# EAGLE design MTV5Beta (EAGLE 6.5.0)
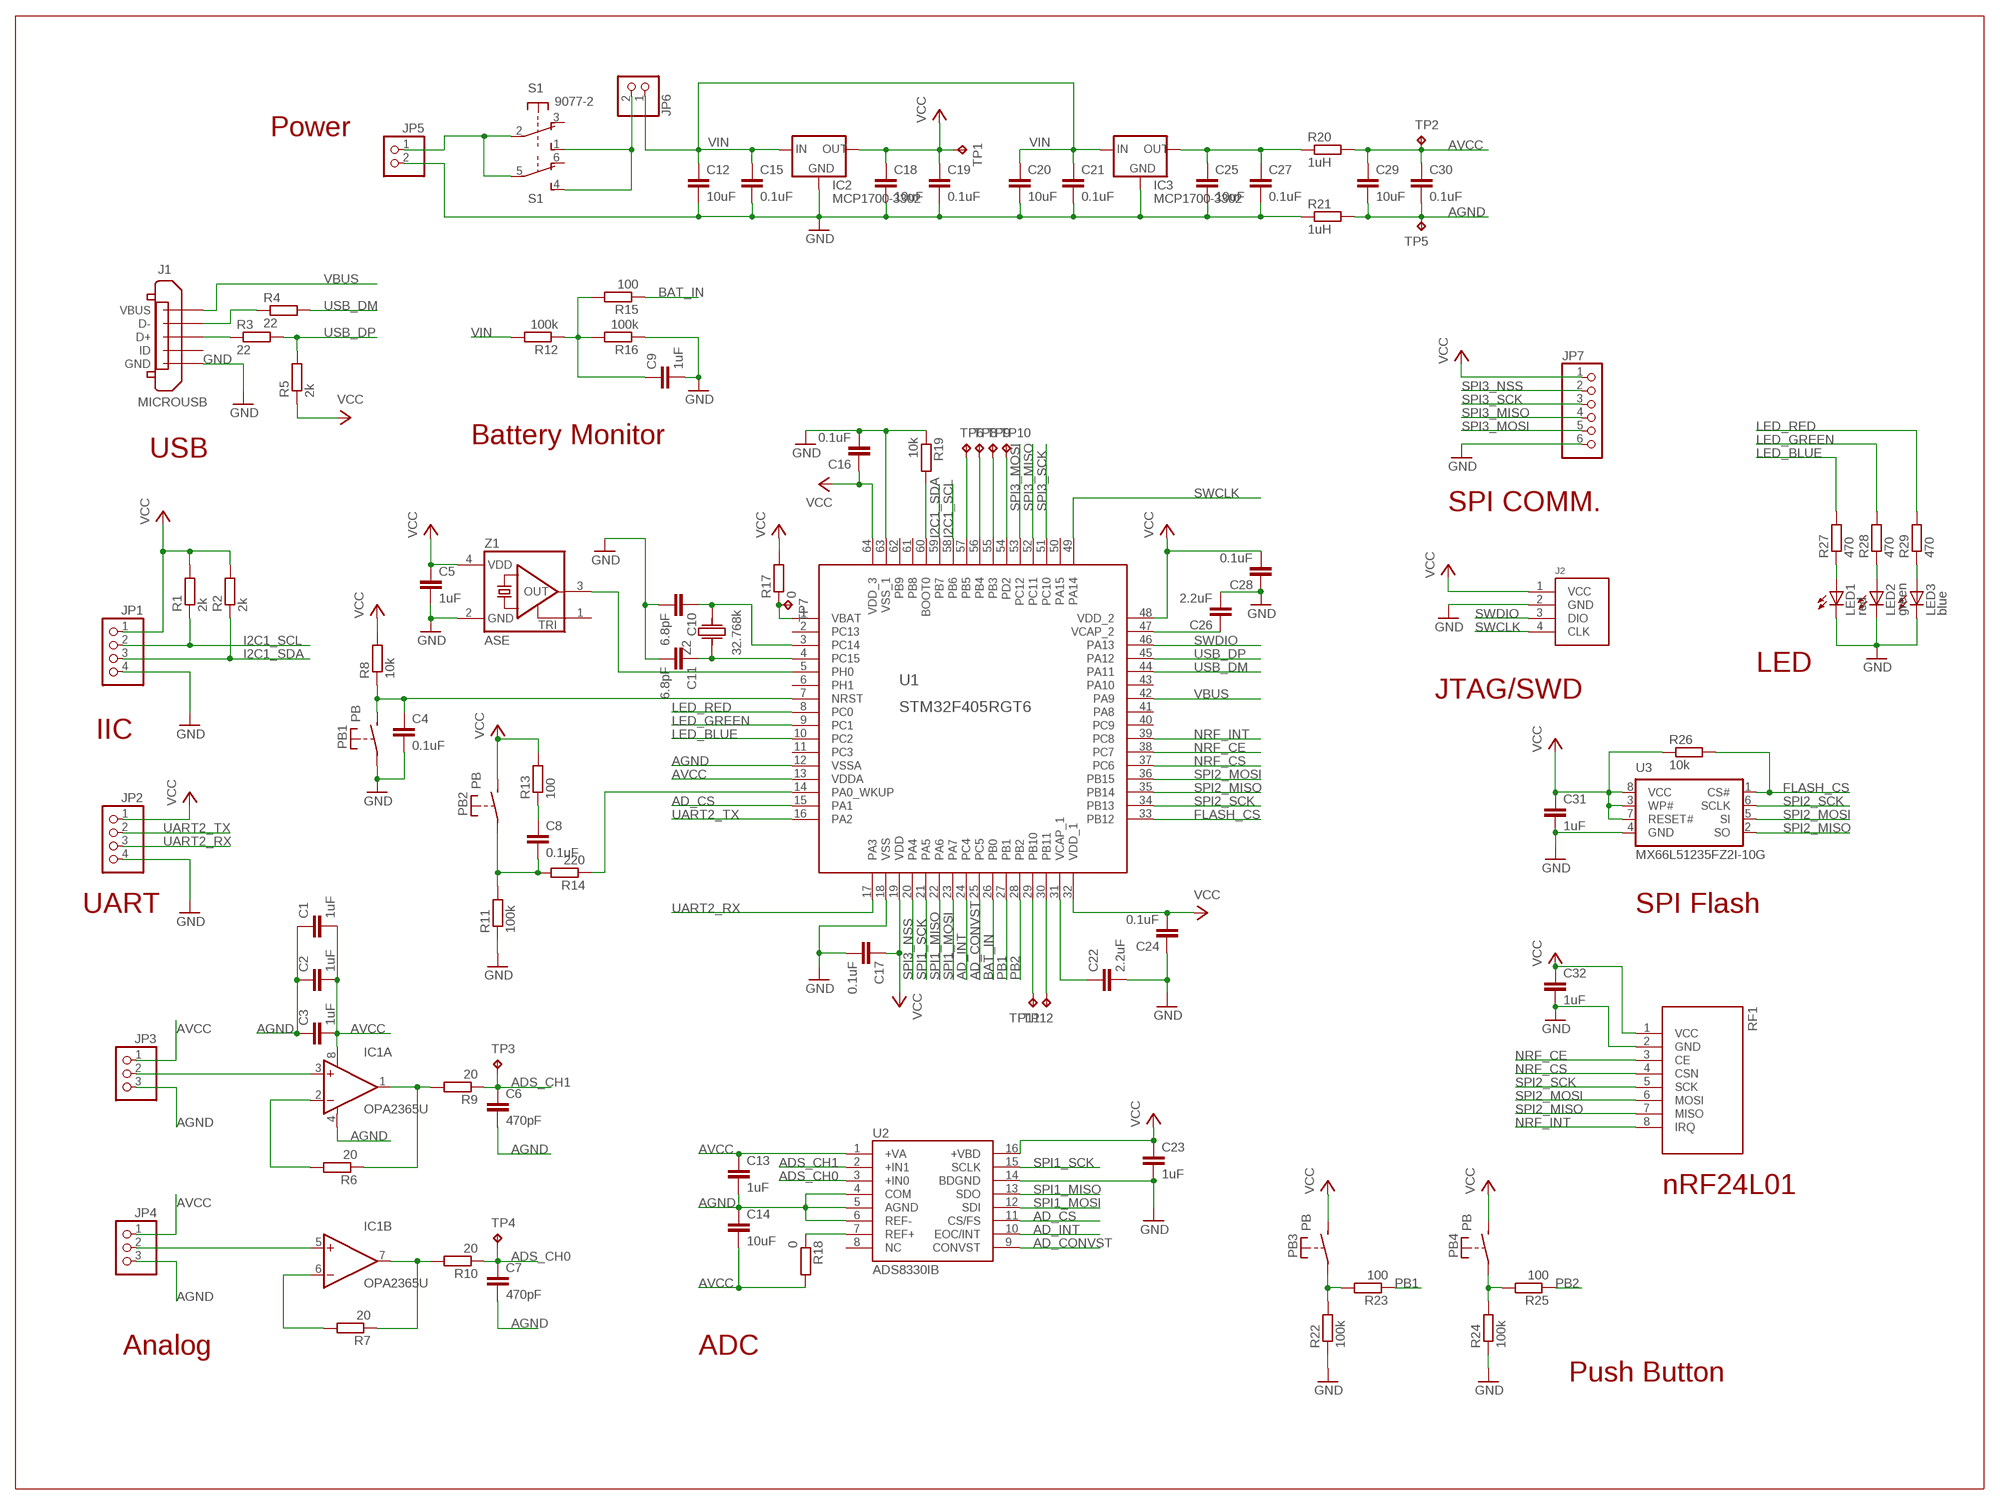
[diagram p0: schematic, sheet 1]

## Parts
C1  1uF  C-EUC0603  [C0603]
C2  1uF  C-EUC0603  [C0603]
C3  1uF  C-EUC0603  [C0603]
C4  0.1uF  C-EUC0603  [C0603]
C5  1uF  C-EUC0603  [C0603]
C6  470pF  C-EUC0603  [C0603]
C7  470pF  C-EUC0603  [C0603]
C8  0.1uF  C-EUC0603  [C0603]
C9  1uF  C-EUC0603  [C0603]
C10  6.8pF  C-EUC0603  [C0603]
C11  6.8pF  C-EUC0603  [C0603]
C12  10uF  C-EUC0603  [C0603]
C13  1uF  C-EUC0603  [C0603]
C14  10uF  C-EUC0603  [C0603]
C15  0.1uF  C-EUC0603  [C0603]
C16  0.1uF  C-EUC0603  [C0603]
C17  0.1uF  C-EUC0603  [C0603]
C18  10uF  C-EUC0603  [C0603]
C19  0.1uF  C-EUC0603  [C0603]
C20  10uF  C-EUC0603  [C0603]
C21  0.1uF  C-EUC0603  [C0603]
C22  2.2uF  C-EUC0603  [C0603]
C23  1uF  C-EUC0603  [C0603]
C24  0.1uF  C-EUC0603  [C0603]
C25  10uF  C-EUC0603  [C0603]
C26  2.2uF  C-EUC0603  [C0603]
C27  0.1uF  C-EUC0603  [C0603]
C28  0.1uF  C-EUC0603  [C0603]
C29  10uF  C-EUC0603  [C0603]
C30  0.1uF  C-EUC0603  [C0603]
C31  1uF  C-EUC0603  [C0603]
C32  1uF  C-EUC0603  [C0603]
IC1  OPA2365U  [SO08]
IC2  MCP1700-3302  XC63FPM  [SOT23]
IC3  MCP1700-3302  XC63FPM  [SOT23]
J1  MICROUSB  [MOLEX47346]
J2  SWDPORT  [125-4P]
JP1  PINHD-1X4  [1X04]
JP2  PINHD-1X4  [1X04]
JP3  PINHD-1X3  [1X03]
JP4  PINHD-1X3  [1X03]
JP5  PINHD-1X2  [1X02]
JP6  PINHD-1X2  [1X02]
JP7  PINHD-1X6  [1X06]
LED1  red  LEDCHIP-LED0805  [CHIP-LED0805]
LED2  green  LEDCHIP-LED0805  [CHIP-LED0805]
LED3  blue  LEDCHIP-LED0805  [CHIP-LED0805]
PB1  PB  [BUTTON]
PB2  PB  [BUTTON]
PB3  PB  [BUTTON]
PB4  PB  [BUTTON]
R1  2k  R-EU_R0603  [R0603]
R2  2k  R-EU_R0603  [R0603]
R3  22  R-EU_R0603  [R0603]
R4  22  R-EU_R0603  [R0603]
R5  2k  R-EU_R0603  [R0603]
R6  20  R-EU_R0603  [R0603]
R7  20  R-EU_R0603  [R0603]
R8  10k  R-EU_R0603  [R0603]
R9  20  R-EU_R0603  [R0603]
R10  20  R-EU_R0603  [R0603]
R11  100k  R-EU_R0603  [R0603]
R12  100k  R-EU_R0603  [R0603]
R13  100  R-EU_R0603  [R0603]
R14  220  R-EU_R0603  [R0603]
R15  100  R-EU_R0603  [R0603]
R16  100k  R-EU_R0603  [R0603]
R17  0  R-EU_R0603  [R0603]
R18  0  R-EU_R0603  [R0603]
R19  10k  R-EU_R0603  [R0603]
R20  1uH  R-EU_R0603  [R0603]
R21  1uH  R-EU_R0603  [R0603]
R22  100k  R-EU_R0603  [R0603]
R23  100  R-EU_R0603  [R0603]
R24  100k  R-EU_R0603  [R0603]
R25  100  R-EU_R0603  [R0603]
R26  10k  R-EU_R0603  [R0603]
R27  470  R-EU_R0603  [R0603]
R28  470  R-EU_R0603  [R0603]
R29  470  R-EU_R0603  [R0603]
RF1  NRF24L01  [NRF24L01-MINI]
S1  9077-2  [9077-2]
TP1  TPB1,27  [B1,27]
TP2  TPB1,27  [B1,27]
TP3  TPB1,27  [B1,27]
TP4  TPB1,27  [B1,27]
TP5  TPB1,27  [B1,27]
TP6  TPB1,27  [B1,27]
TP7  TPB1,27  [B1,27]
TP8  TPB1,27  [B1,27]
TP9  TPB1,27  [B1,27]
TP10  TPB1,27  [B1,27]
TP11  TPB1,27  [B1,27]
TP12  TPB1,27  [B1,27]
U1  STM32F405RGT6  [LQFP64]
U2  ADS8330IB  [TSSOP16]
U3  MX66L51235FZ2I-10G  [WSON8L]
Z1  ASE  [ASE]
Z2  32.768k  CRYSTAL-CM315  [CM315]

## Nets
AD_CONVST: U1.25(PC5) U2.9(CONVST)
AD_CS: U1.15(PA1) U2.11(CS/FS)
AD_INT: U1.24(PC4) U2.10(EOC/INT)
ADS_CH0: C7.1 R10.1 TP4.TP U2.3(+IN0)
ADS_CH1: C6.1 R9.1 TP3.TP U2.2(+IN1)
AGND: C1.1 C2.1 C3.1 C6.2 C7.2 C13.2 C14.1 C29.2 C30.2 IC1.4(A:V-) JP3.3 JP4.3 R21.2 TP5.TP U1.12(VSSA) U2.4(COM) U2.5(AGND) U2.6(REF-)
AVCC: C1.2 C2.2 C3.2 C13.1 C14.2 C29.1 C30.1 IC1.8(A:V+) JP3.1 JP4.1 R18.2 R20.2 TP2.TP U1.13(VDDA) U2.1(+VA)
BAT_IN: R15.1 U1.26(PB0)
FLASH_CS: R26.2 U1.33(PB12) U3.1(CS#)
GND: C4.2 C5.2 C9.2 C10.2 C11.2 C12.2 C15.2 C16.2 C17.2 C18.2 C19.2 C20.2 C21.2 C22.2 C23.2 C24.1 C25.2 C26.2 C27.2 C28.1 C31.2 C32.2 IC2.1(GND) IC3.1(GND) J1.5(GND) J2.2(GND) JP1.4 JP2.4 JP5.2 JP7.6 LED1.C LED2.C LED3.C PB1.1(P) R11.1 R16.1 R19.1 R21.1 R22.1 R24.1 RF1.2(GND) U1.18(VSS) U1.63(VSS_1) U2.14(BDGND) U3.4(GND) Z1.2(GND)
I2C1_SCL: JP1.2 R1.1 U1.58(PB6)
I2C1_SDA: JP1.3 R2.1 U1.59(PB7)
LED_BLUE: R27.2 U1.10(PC2)
LED_GREEN: R28.2 U1.9(PC1)
LED_RED: R29.2 U1.8(PC0)
N$1: R19.2 U1.60(BOOT0)
N$2: J1.2(D-) R4.1
N$3: J1.3(D+) R3.1
N$4: C22.1 U1.31(VCAP_1)
N$5: IC1.1(A:OUT) R6.1 R9.2
N$6: C4.1 PB1.2(S) R8.1 U1.7(NRST)
N$7: C25.1 C27.1 IC3.2(OUT) R20.1
N$8: IC1.2(A:-IN) R6.2
N$9: IC1.3(A:+IN) JP3.2
N$10: U1.5(PH0) Z1.3(OUT)
N$11: C26.1 U1.47(VCAP_2)
N$12: IC1.5(B:+IN) JP4.2
N$13: IC1.7(B:OUT) R7.1 R10.2
N$14: C9.1 R12.1 R15.2 R16.2
N$15: IC1.6(B:-IN) R7.2
N$16: JP6.2 S1.1(1:S) S1.4(2:S)
N$17: JP5.1 S1.2(1:P) S1.5(2:P)
N$18: C8.1 R13.1
N$19: LED1.A R27.1
N$20: C8.2 PB2.1(P) R11.2 R14.2
N$21: LED2.A R28.1
N$22: R14.1 U1.14(PA0_WKUP)
N$23: LED3.A R29.1
N$24: R17.1 TP7.TP U1.1(VBAT)
N$25: C10.1 U1.3(PC14) Z2.2(X2)
N$26: C11.1 U1.4(PC15) Z2.1(X1)
N$27: PB3.1(P) R22.2 R23.2
N$28: TP6.TP U1.57(PB5)
N$29: PB4.1(P) R24.2 R25.2
N$30: TP8.TP U1.56(PB4)
N$31: TP9.TP U1.55(PB3)
N$32: TP10.TP U1.54(PD2)
N$34: TP11.TP U1.29(PB10)
N$35: TP12.TP U1.30(PB11)
N$41: R18.1 U2.7(REF+)
NRF_CE: RF1.3(CE) U1.38(PC7)
NRF_CS: RF1.4(CSN) U1.37(PC6)
NRF_INT: RF1.8(IRQ) U1.39(PC8)
PB1: R23.1 U1.27(PB1)
PB2: R25.1 U1.28(PB2)
SPI1_MISO: U1.22(PA6) U2.13(SDO)
SPI1_MOSI: U1.23(PA7) U2.12(SDI)
SPI1_SCK: U1.21(PA5) U2.15(SCLK)
SPI2_MISO: RF1.7(MISO) U1.35(PB14) U3.2(SO)
SPI2_MOSI: RF1.6(MOSI) U1.36(PB15) U3.5(SI)
SPI2_SCK: RF1.5(SCK) U1.34(PB13) U3.6(SCLK)
SPI3_MISO: JP7.4 U1.52(PC11)
SPI3_MOSI: JP7.5 U1.53(PC12)
SPI3_NSS: JP7.2 U1.20(PA4)
SPI3_SCK: JP7.3 U1.51(PC10)
SWCLK: J2.4(CLK) U1.49(PA14)
SWDIO: J2.3(DIO) U1.46(PA13)
UART2_RX: JP2.3 U1.17(PA3)
UART2_TX: JP2.2 U1.16(PA2)
USB_DM: R4.2 U1.44(PA11)
USB_DP: R3.2 R5.2 U1.45(PA12)
VBUS: J1.1(VBUS) U1.42(PA9)
VCC: C5.1 C16.1 C17.1 C18.1 C19.1 C23.1 C24.2 C28.2 C31.1 C32.1 IC2.2(OUT) J2.1(VCC) JP1.1 JP2.1 JP7.1 PB2.2(S) PB3.2(S) PB4.2(S) R1.2 R2.2 R5.1 R8.2 R13.2 R17.2 R26.1 RF1.1(VCC) TP1.TP U1.19(VDD) U1.32(VDD_1) U1.48(VDD_2) U1.64(VDD_3) U2.16(+VBD) U3.3(WP#) U3.7(RESET#) U3.8(VCC) Z1.4(VDD)
VIN: C12.1 C15.1 C20.1 C21.1 IC2.3(IN) IC3.3(IN) JP6.1 R12.2
Unconnected: J1.4(ID) S1.3(1:O) S1.6(2:O) U1.2(PC13) U1.6(PH1) U1.11(PC3) U1.40(PC9) U1.41(PA8) U1.43(PA10) U1.50(PA15) U1.61(PB8) U1.62(PB9) U2.8(NC) Z1.1(TRI)

## Notes on the sheet
- Power
- Battery Monitor
- USB
- SPI COMM.
- LED
- JTAG/SWD
- IIC
- UART | SPI Flash
- nRF24L01
- Analog | ADC
- Push Button

## Library data of the parts
C1-C32 = rcl:C-EU: CAPACITOR, European symbol
IC1 = EF_Lib:OPA2365: Operational Amplifier; MF: TEXAS INSTRUMENTS; MPN: OPA2134UA; OC_FARNELL: 1206935; OC_NEWARK: 35C1847
IC2 IC3 = LDO:XC63FP: Positiv Voltage Regulators www.torex.co.jp/english/product/pro02/pdf/0201_xc62fp.pdf
J1 = EF_Lib:MICROUSB: MICRO USB-B Conector
J2 = EF_Lib:SWDPORT
JP1 JP2 = pinhead:PINHD-1X4: PIN HEADER
JP3 JP4 = pinhead:PINHD-1X3: PIN HEADER
JP5 JP6 = pinhead:PINHD-1X2: PIN HEADER
JP7 = pinhead:PINHD-1X6: PIN HEADER
LED1-LED3 = led:LED: LED OSRAM: - CHIPLED LG R971, LG N971, LY N971, LG Q971, LY Q971, LO R971, LY R971 LH N974, LH R974 LS Q976, LO Q976, LY Q976 LO Q996 - Hyper CHIPLED LW Q18S LB Q993, LB Q99A, LB R99A - SideLED LS A670, LO A670, LY A670, LG A670, LP A670 LB A673, LV A673, LT A673, LW A673 LH A674 LY A675 LS A676, LA A676, LO A676, LY A676, LW A676 LS A679, LY A679, LG A679 - Hyper Micro SIDELED® LS Y876, LA Y876, LO Y876, LY Y876 LT Y87S - SmartLED LW L88C, LW L88S LB L89C, LB L89S, LG L890 LS L89K, LO L89K, LY L89K LS L896, LA L896, LO L896, LY L896 - TOPLED LS T670, LO T670, LY T670, LG T670, LP T670 LSG T670, LSP T670, LSY T670, LOP T670, LYG T670 LG T671, LOG T671, LSG T671 LB T673, LV T673, LT T673, LW T673 LH T674 LS T676, LA T676, LO T676, LY T676, LB T676, LH T676, LSB T676, LW T676 LB T67C, LV T67C, LT T67C, LS T67K, LO T67K, LY T67K, LW E67C LS E67B, LA E67B, LO E67B, LY E67B, LB E67C, LV E67C, LT E67C LW T67C LS T679, LY T679, LG T679 LS T770, LO T770, LY T770, LG T770, LP T770 LB T773, LV T773, LT T773, LW T773 LH T774 LS E675, LA E675, LY E675, LS T675 LS T776, LA T776, LO T776, LY T776, LB T776 LHGB T686 LT T68C, LB T68C - Hyper Mini TOPLED® LB M676 - Mini TOPLED Santana® LG M470 LS M47K, LO M47K, LY M47K Source: http://www.osram.convergy.de LUXEON: - LUMILED® LXK2-PW12-R00, LXK2-PW12-S00, LXK2-PW14-U00, LXK2-PW14-V00 LXK2-PM12-R00, LXK2-PM12-S00, LXK2-PM14-U00 LXK2-PE12-Q00, LXK2-PE12-R00, LXK2-PE12-S00, LXK2-PE14-T00, LXK2-PE14-U00 LXK2-PB12-K00, LXK2-PB12-L00, LXK2-PB12-M00, LXK2-PB14-N00, LXK2-PB14-P00, LXK2-PB14-Q00 LXK2-PR12-L00, LXK2-PR12-M00, LXK2-PR14-Q00, LXK2-PR14-R00 LXK2-PD12-Q00, LXK2-PD12-R00, LXK2-PD12-S00 LXK2-PH12-R00, LXK2-PH12-S00 LXK2-PL12-P00, LXK2-PL12-Q00, LXK2-PL12-R00 Source: www.luxeon.com KINGBRIGHT: KA-3528ASYC Source: www.kingbright.com
PB1-PB4 = switch-misc:PB
R1-R29 = rcl:R-EU_: RESISTOR, European symbol
RF1 = EF_Lib:NRF24L01
S1 = switch-misc:9077-2: MARQUARDT SWITCH 9077.0200 Distributor: Buerklin <https://www.buerklin.com/default.asp?event=ShowArtikel%2812G2822%29&l=d&jump=ArtNr_12G2822>
TP1-TP12 = testpad:TP: Test pad
U1 = EF_Lib:STM32F405RGT6
U2 = EF_Lib:ADS8330IB: http://www.ti.com/lit/ds/symlink/ads8330.pdf
U3 = EF_Lib:MX66L51235FZ2I-10G: NOR Flash Memory (64M)
Z1 = crystal:ASE: 3.3Vdc CMOS SMD CRYSTAL CLOCK OSCILLATOR SOurce: www.abracon.com; OC_FARNELL: unknown; OC_NEWARK: unknown
Z2 = EF_Lib:CRYSTAL-CM315

## Board
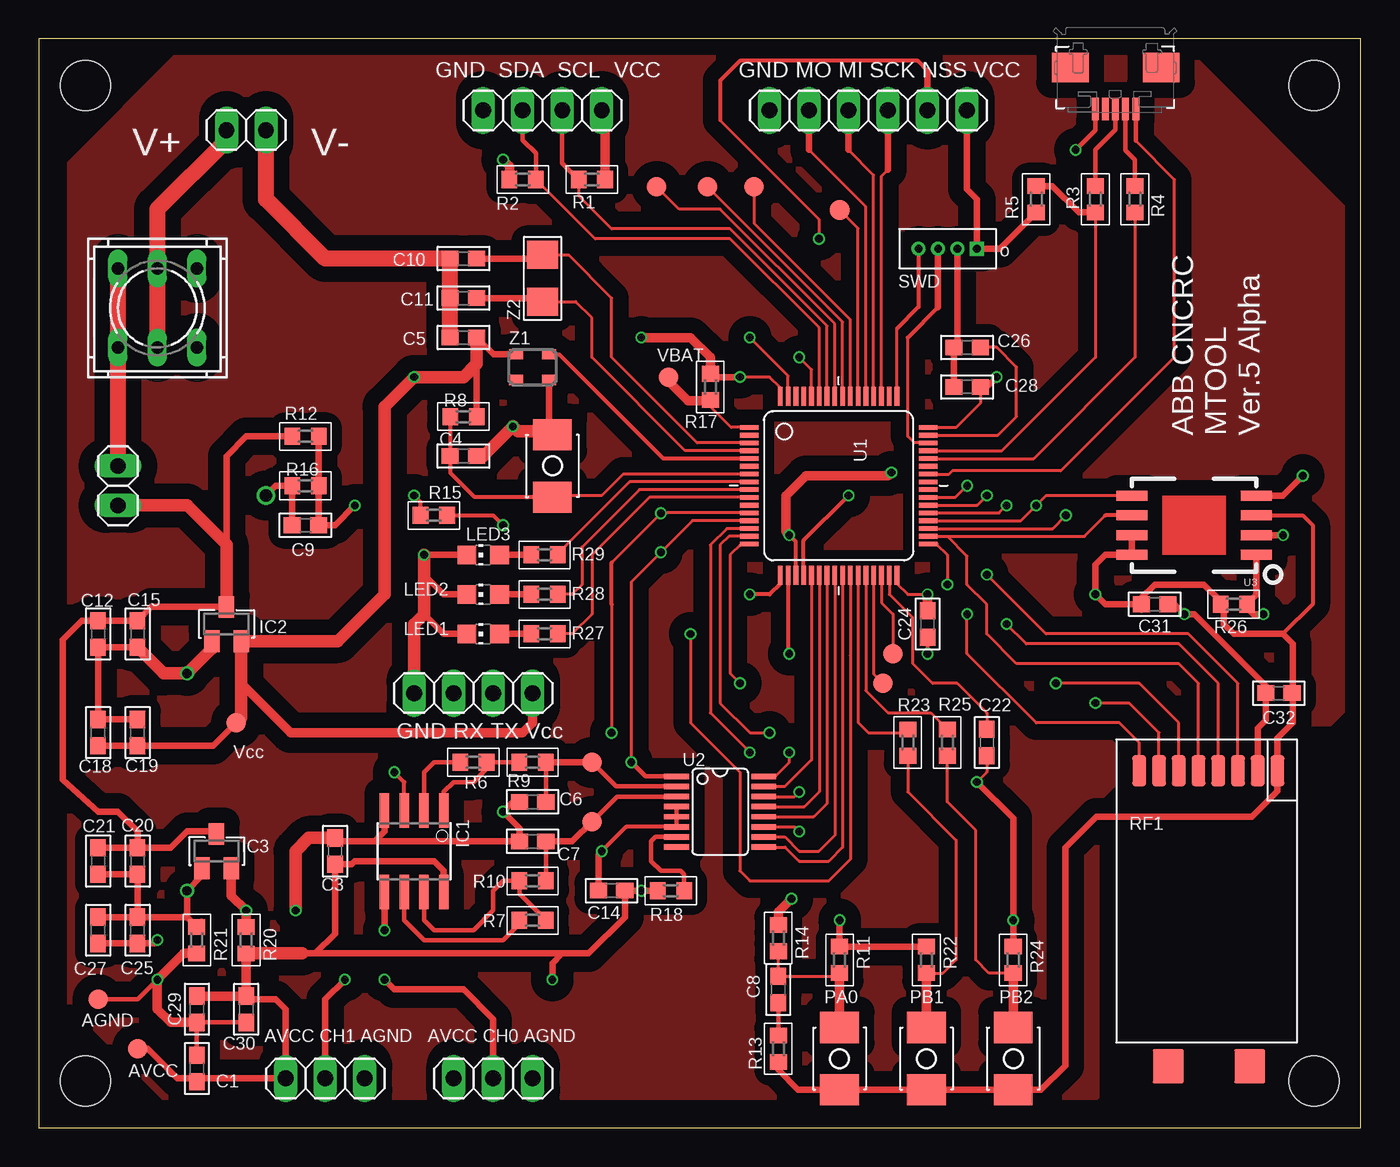
[diagram p1: board, top side]
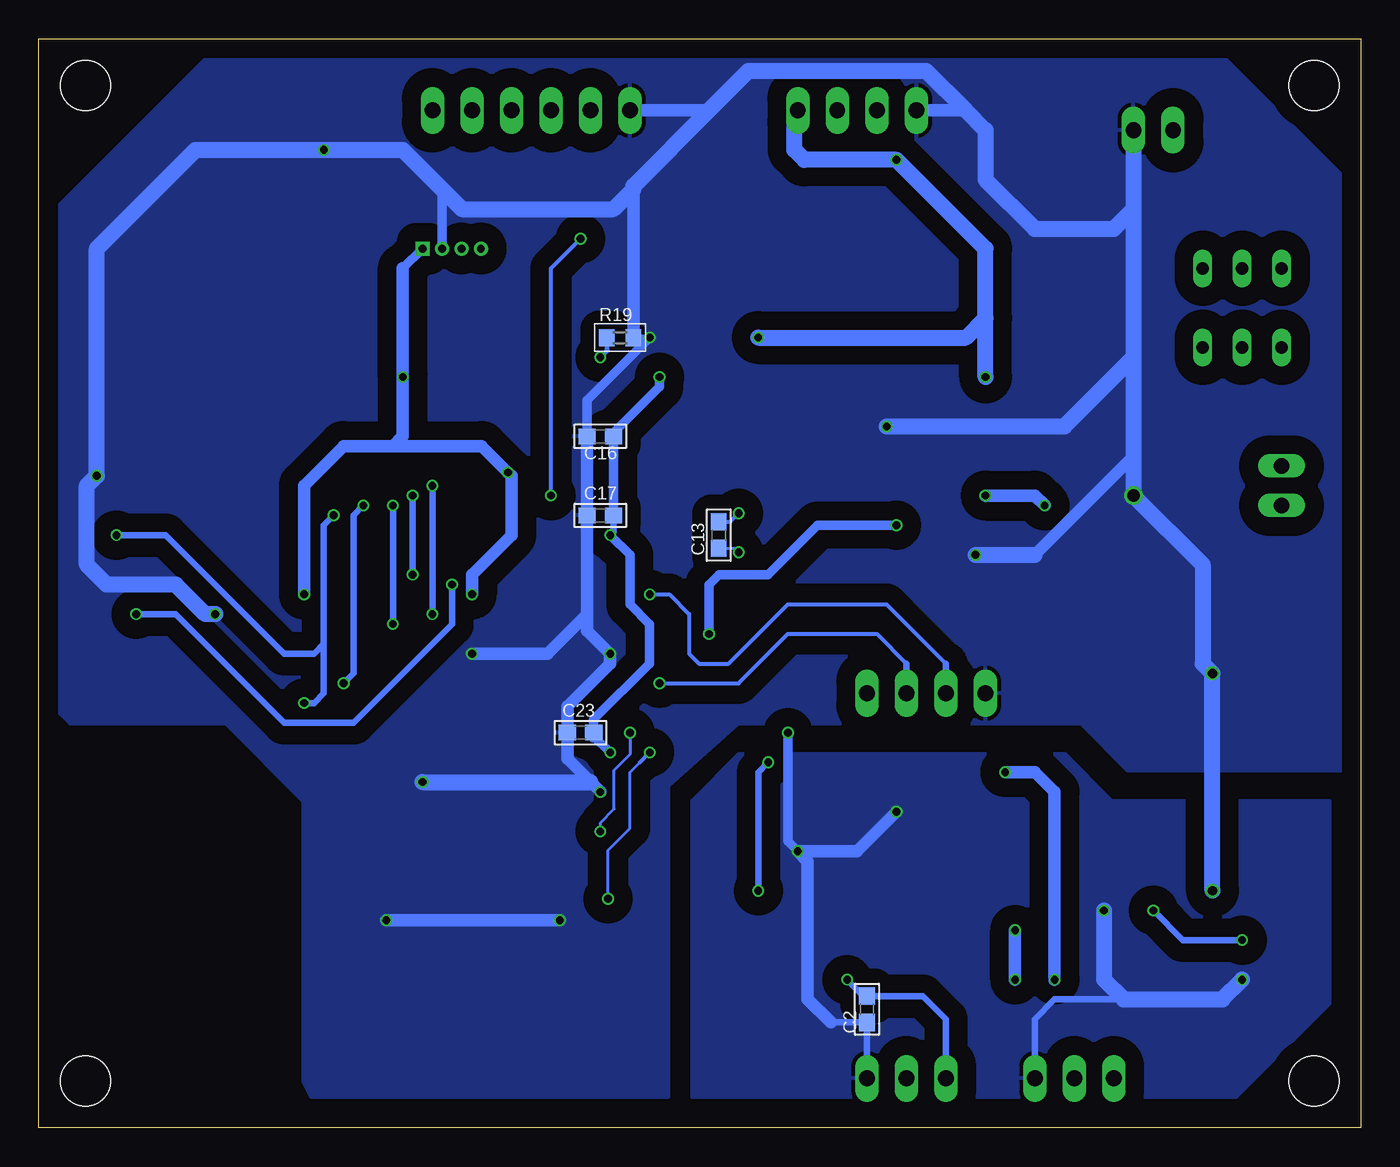
[diagram p2: board, bottom side, seen from below]

Size 85 x 70 mm. Coordinates in mm from the lower left corner, seen from the top.
Outline: 0,0 85,0 85,70 0,70 0,0
Copper layers (1*16): Top 0.035mm / dielectric 1.5mm / Bottom 0.035mm
Design rules "default *": minimum track width 0.149859375mm, minimum drill 0.45mm, track to track 5mil, track to pad 5mil, pad to pad 6mil, via to via 6mil, smd to smd 2mil, copper to edge 40mil, drill to drill 8mil, minimum pad ring 5mil, minimum via ring 5mil, stop-mask expansion 4mil, vias tented up to drill 0.51mm, thermal gap 10mil
Holes 3.2 mm at 3,67 82,67 82,3 3,3

### Footprints (pad centres in the part's own frame; a part is rotated, then mirrored left to right if it is on the bottom)
C0603 = smd 1.1 x 1: 1 -0.85,0; 2 0.85,0
SO08 = smd 0.61 x 2.21: 1 -1.905,-2.616; 2 -0.635,-2.616; 3 0.635,-2.616; 4 1.905,-2.616; 5 1.905,2.616; 6 0.635,2.616; 7 -0.635,2.616; 8 -1.905,2.616
SOT23 = smd 1 x 1.4: 1 -0.95,-1.1; 2 0.95,-1.1; 3 0,1.1
MOLEX47346 = smd 1.46 x 0.45: 1 1.81,1.32; 2 1.81,0.67; 3 1.81,0.02; 4 1.81,-0.63; 5 1.81,-1.28 | smd 1.9 x 2.37: M1 -0.85,2.95; M2 -0.85,-2.89
125-4P = drill 0.5 pad 0.9 square: 1 0,0 | drill 0.5 pad 0.9: 2 1.25,0; 3 2.5,0; 4 3.75,0
1X04 = drill 1.016 long: 1 -3.81,0; 2 -1.27,0; 3 1.27,0; 4 3.81,0
1X03 = drill 1.016 long: 1 -2.54,0; 2 0,0; 3 2.54,0
1X02 = drill 1.016 long: 1 -1.27,0; 2 1.27,0
1X06 = drill 1.016 long: 1 -6.35,0; 2 -3.81,0; 3 -1.27,0; 4 1.27,0; 5 3.81,0; 6 6.35,0
CHIP-LED0805 = smd 1.2 x 1.2: A 0,-1.05; C 0,1.05
BUTTON = smd 2.5 x 2: 1 0,2; 2 0,-2
R0603 = smd 1 x 1.1: 1 -0.85,0; 2 0.85,0
NRF24L01-MINI = smd 0.9 x 2: 1 9.525,0; 2 8.255,0; 3 6.985,0; 4 5.715,0; 5 4.445,0; 6 3.175,0; 7 1.905,0; 8 0.635,0 | smd 2 x 2.2: ANT1 2.5,-19; ANT2 7.75,-19
9077-2 = drill 0.813 long: 1 -2.54,2.54; 2 0,2.54; 3 2.54,2.54; 4 -2.54,-2.54; 5 0,-2.54; 6 2.54,-2.54
B1,27 = smd 1.27 x 1.27: TP 0,0
LQFP64 = smd 0.3 x 1.2: 1 -3.75,-5.75; 2 -3.25,-5.75; 3 -2.75,-5.75; 4 -2.25,-5.75; 5 -1.75,-5.75; 6 -1.25,-5.75; 7 -0.75,-5.75; 8 -0.25,-5.75; 9 0.25,-5.75; 10 0.75,-5.75; 11 1.25,-5.75; 12 1.75,-5.75; 13 2.25,-5.75; 14 2.75,-5.75; 15 3.25,-5.75; 16 3.75,-5.75; 33 3.75,5.75; 34 3.25,5.75; 35 2.75,5.75; 36 2.25,5.75; 37 1.75,5.75; 38 1.25,5.75; 39 0.75,5.75; 40 0.25,5.75; 41 -0.25,5.75; 42 -0.75,5.75; 43 -1.25,5.75; 44 -1.75,5.75; 45 -2.25,5.75; 46 -2.75,5.75; 47 -3.25,5.75; 48 -3.75,5.75 | smd 1.2 x 0.3: 17 5.75,-3.75; 18 5.75,-3.25; 19 5.75,-2.75; 20 5.75,-2.25; 21 5.75,-1.75; 22 5.75,-1.25; 23 5.75,-0.75; 24 5.75,-0.25; 25 5.75,0.25; 26 5.75,0.75; 27 5.75,1.25; 28 5.75,1.75; 29 5.75,2.25; 30 5.75,2.75; 31 5.75,3.25; 32 5.75,3.75; 49 -5.75,3.75; 50 -5.75,3.25; 51 -5.75,2.75; 52 -5.75,2.25; 53 -5.75,1.75; 54 -5.75,1.25; 55 -5.75,0.75; 56 -5.75,0.25; 57 -5.75,-0.25; 58 -5.75,-0.75; 59 -5.75,-1.25; 60 -5.75,-1.75; 61 -5.75,-2.25; 62 -5.75,-2.75; 63 -5.75,-3.25; 64 -5.75,-3.75
TSSOP16 = smd 1.6 x 0.35: 1 -2.8,2.275; 2 -2.8,1.625; 3 -2.8,0.975; 4 -2.8,0.325; 5 -2.8,-0.325; 6 -2.8,-0.975; 7 -2.8,-1.625; 8 -2.8,-2.275; 9 2.8,-2.275; 10 2.8,-1.625; 11 2.8,-0.975; 12 2.8,-0.325; 13 2.8,0.325; 14 2.8,0.975; 15 2.8,1.625; 16 2.8,2.275
WSON8L = smd 2 x 0.635: 1 -4,0; 2 -4,-1.27; 3 -4,-2.54; 4 -4,-3.81; 5 4,-3.81; 6 4,-2.54; 7 4,-1.27; 8 4,0
ASE = smd 0.9 x 0.65: 1 -1.05,-0.825; 2 1.05,-0.825; 3 1.05,0.825; 4 -1.05,0.825
CM315 = smd 1.8 x 2: 1 -1.5,0; 2 1.5,0

### Placement (x,y rotation side)
C1  10.16,3.81 270 top
C2  31.75,7.62 90 bottom
C3  19.05,17.78 270 top
C4  27.3,43.18 0 top
C5  27.3,50.8 180 top
C6  31.75,20.95 180 top
C7  31.75,18.41 180 top
C8  47.55,8.89 90 top
C9  17.14,38.73 180 top
C10  27.3,55.88 180 top
C11  27.3,53.34 180 top
C12  3.81,31.75 270 top
C13  41.27,38.1 90 bottom
C14  36.83,15.24 0 top
C15  6.35,31.75 270 top
C16  48.9,44.45 180 bottom
C17  48.9,39.37 180 bottom
C18  3.81,25.4 90 top
C19  6.35,25.4 90 top
C20  6.35,17.14 270 top
C21  3.81,17.14 270 top
C22  60.96,24.77 270 top
C23  50.16,25.4 180 bottom
C24  57.15,32.38 90 top
C25  6.35,12.7 90 top
C26  59.69,50.16 180 top
C27  3.81,12.7 90 top
C28  59.69,47.62 0 top
C29  10.16,7.62 270 top
C30  13.34,7.62 270 top
C31  71.75,33.66 0 top
C32  79.74,27.94 180 top
IC1  24.13,17.78 180 top
IC2  12.06,32.38 0 top
IC3  11.43,17.78 0 top
J1  69.22,67.31 270 top
J2  60.33,56.52 180 top
JP1  32.38,65.41 180 top
JP2  27.94,27.94 180 top
JP3  18.41,3.17 0 top
JP4  29.21,3.17 0 top
JP5  13.34,64.14 0 top
JP6  5.08,41.27 90 top
JP7  53.34,65.41 180 top
LED1  28.57,31.75 90 top
LED2  28.57,34.29 90 top
LED3  28.57,36.83 90 top
PB1  33.02,42.55 0 top
PB2  51.49,4.45 0 top
PB3  57.08,4.45 0 top
PB4  62.66,4.45 0 top
R1  35.56,60.96 0 top
R2  31.11,60.96 180 top
R3  67.94,59.69 270 top
R4  70.48,59.69 270 top
R5  64.14,59.69 90 top
R6  27.94,23.5 180 top
R7  31.75,13.34 180 top
R8  27.3,45.72 0 top
R9  31.75,23.5 180 top
R10  31.75,15.88 180 top
R11  51.49,10.79 270 top
R12  17.14,44.45 180 top
R13  47.55,5.08 270 top
R14  47.55,12.2 270 top
R15  25.4,39.37 180 top
R16  17.14,41.27 0 top
R17  43.18,47.62 90 top
R18  40.64,15.24 180 top
R19  47.62,50.8 180 bottom
R20  13.34,12.06 270 top
R21  10.16,12.06 270 top
R22  57.08,10.79 270 top
R23  55.88,24.77 270 top
R24  62.66,10.79 270 top
R25  58.42,24.77 270 top
R26  76.83,33.66 0 top
R27  32.52,31.75 0 top
R28  32.52,34.29 0 top
R29  32.52,36.83 0 top
RF1  70.12,22.95 0 top
S1  7.62,52.7 0 top
TP1  12.7,26.04 0 top
TP2  6.35,5.08 0 top
TP3  35.56,23.5 0 top
TP4  35.56,19.68 0 top
TP5  3.81,8.26 0 top
TP6  39.73,60.5 0 top
TP7  40.5,48.25 0 top
TP8  43,60.5 0 top
TP9  46,60.5 0 top
TP10  51.5,59 0 top
TP11  54.29,28.57 0 top
TP12  54.93,30.48 0 top
U1  51.44,41.27 270 top
U2  43.81,20.32 0 top
U3  74.3,36.83 180 top
Z1  31.75,48.9 0 top
Z2  32.38,54.61 90 top

### Tracks (layer width: path | path; a pad name or v marks a point on that pad's centre or on a via)
AD_CONVST
  Top 0.203: U1.25 51.69,18.03 50.8,17.14 48.9,17.14 47.99,18.05 U2.9
AD_CS  (via drill 0.5)
  Top 0.203: U2.11 48.6,19.34 v48.9,19.05 | U1.15 44.38,38.02 43.81,37.47 43.81,27.3 45.72,25.4 v46.99,25.4
  Bottom 0.203: v46.99,25.4 46.99,24.01 47.75,23.25 48,23 48,20.5 48.9,19.61 v48.9,19.05
AD_INT
  Top 0.203: U1.24 51.19,18.8 50.16,17.78 48.9,17.78 47.98,18.7 U2.10
ADS_CH0
  Top 0.305: U2.3 37.17,21.3 TP4.TP | R10.1 C7.1
  Top 0.406: C7.1 34.29,18.41 TP4.TP
ADS_CH1
  Top 0.305: U2.2 37.11,21.95 TP3.TP | C6.1 R9.1
  Top 0.406: TP3.TP R9.1
AGND  (via drill 0.5)
  Top 0.203: 36.83,33.66 v36.83,25.4 | U1.12 40.02,39.52 v40,39.5 36.83,36.33
  Top 0.254: U2.6 37.76,19.34 v36.2,17.78 | 36.83,33.66 36.83,36.33
  Top 0.305: U2.4 U2.5 U2.6 | C30.2 C29.2 C1.1 | TP5.TP 6.35,8.26 v7.62,9.53
  Top 0.406: 21.59,18.41 C7.2 30.9,19.27 v29.84,20.32 30.48,20.95 C6.2 | 21.59,18.41 19.27,18.41 C3.1 | C14.1 35.98,17.57 v36.2,17.78 | IC1.4 22.23,19.05 21.59,18.41
  Top 0.61: R21.2 9.31,11.21 v7.62,9.53 7.62,7.62 8.47,6.77 C29.2
  Top 0.813: C3.1 17.36,18.63 16.51,17.78 v16.51,13.97
  Bottom 0.254: C13.2 40.55,38.95 v40,39.5
  Bottom 0.406: JP4.3 C2.1 34.08,6.77 | JP3.3 20.95,6.99 19.68,8.26 15.24,8.26
  Bottom 0.61: v36.83,25.4 36.83,18.41 v36.2,17.78
  Bottom 0.813: v29.84,20.32 32.38,17.78 v36.2,17.78 35.56,17.14 35.56,8.26 34.08,6.77
  Bottom 1.016: v16.51,13.97 16.51,9.53 15.24,8.26 8.89,8.26 v7.62,9.53
  pour Bottom (isolate 1.2): 2,21 16,21 19,24 40,24 43,21 43,2 8,2 2,8
AVCC  (via drill 0.5)
  Top 0.203: U1.13 42.02,39.02 v40,37 38.1,35.1 38.1,33.52 v38.1,23.5
  Top 0.305: U2.1 39,22.59 v38.1,23.5 | 13.55,8.26 C30.1 | 10.38,3.17 C1.2 9.95,3.17
  Top 0.406: IC1.8 26.04,16.51 25.4,17.14 20.32,17.14 20.11,16.93 C3.2 19.05,12.48 17.78,11.21 | 16.93,11.21 17.78,11.21 | 17.78,11.21 33.66,11.21 | 33.66,11.21 35.34,11.21 37.68,13.55 C14.2 v38.73,15.24 R18.2 | 13.55,8.26 15.24,8.26 15.88,7.62 JP3.1 10.38,3.17 | TP2.TP 6.99,5.08 8.89,3.17 9.95,3.17 | v33.02,9.53 33.02,10.58 33.66,11.21
  Top 0.61: C29.1 C30.1 R20.2
  Top 0.813: R20.2 16.93,11.21
  Bottom 0.203: C13.1 40.25,37.25 v40,37
  Bottom 0.406: v38.73,15.24 38.73,22.86 v38.1,23.5 | C2.2 28.16,8.47 26.67,6.99 JP4.1 | 31.96,8.47 v33.02,9.53
  Bottom 0.61: C2.2 31.96,8.47
BAT_IN  (via drill 0.5)
  Top 0.203: U1.26 52.19,30.36 52.19,17.26 50.8,15.88 46.35,15.88 45.72,15.88 45.09,16.51 45.09,22.86 44.45,23.5 41.91,26.04 v41.91,31.75
  Top 0.254: R15.1 29.21,39.37 v29.84,38.73
  Bottom 0.61: v29.84,38.73 34.92,38.73 38.1,35.56 41.27,35.56 41.91,34.92 v41.91,31.75
FLASH_CS  (via drill 0.5)
  Top 0.203: 57.73,37.52 58.42,36.83 v58.42,34.92
  Top 0.254: U1.33 57.73,37.52
  Top 0.406: U3.1 78.3,34.27 R26.2 77.69,33.44 78.11,33.02 v78.74,33.02
  Bottom 0.406: v78.74,33.02 76.2,33.02 69.22,26.04 64.77,26.04 58.42,32.38 v58.42,34.92
GND  (via drill 0.5, 0.6, 0.8)
  Top 0.203: U1.63 48.19,48.34 v45.72,50.8 | U2.14 48.6,21.3 v48.9,21.59 | C22.2 60.96,22.86 v60.33,22.23
  Top 0.254: 32.8,44.77 PB1.1 | U1.18 48.19,30.55 v48.26,30.48 | C24.1 v57.15,30.48
  Top 0.305: J1.5 67.94,64.12 v66.67,62.87
  Top 0.406: C9.2 R16.1 15.24,41.27 v14.61,40.64 | C15.2 C12.2 C18.2 C19.2 | C21.2 C20.2 C25.2 | 10.48,13.23 R21.1 9.53,13.55 | C25.2 9.53,13.55 | C25.2 C27.2 | LED1.C 26.04,31.75 24.77,33.02 | LED2.C 26.04,34.29 24.77,35.56 | 32.8,44.77 Z1.2 | IC3.1 10.48,16.2 v9.53,15.24 9.53,13.55 | LED3.C v24.77,36.83 | C28.1 C26.2 59.08,50.4 J2.2 | U3.4 80.01,40.64 v81.28,41.91 | C31.2 73.03,33.66 v73.66,33.02 74.3,33.02 78.89,28.43 C32.2 78.89,26.18 78.38,25.67 RF1.2 | R22.1 R11.1 v51.49,13.34 | R24.1 v62.66,13.34 62.66,19.89 v60.33,22.23
  Top 0.813: IC2.1 11.12,30.8 v9.53,29.21 8.04,29.21 C15.2 | 32.8,44.77 30.8,44.77 v30.48,45.09 28.57,43.18 C4.2 | v24.77,36.83 24.77,35.56 24.77,33.02 24.13,32.38 JP2.4
  Top 1.016: JP5.2 14.61,59.69 18.41,55.88 C10.2 C11.2 C5.2
  Bottom 0.305: 59.05,56.53 J2.2
  Bottom 0.406: R19.1 v45.72,50.8 | 49.53,22.23 v48.9,21.59
  Bottom 0.61: J2.2 59.08,57.77 | 59.05,60.33 59.05,56.53 | C16.2 49.74,46.77 v45.72,50.8
  Bottom 0.813: 20.95,36.83 14.61,43.18 | R19.1 46.77,60.33 46.77,60.54 | JP7.6 41.91,65.41 | JP1.4 25.4,65.41 | C16.2 C17.2 49.74,33.02 | 49.74,33.02 49.74,31.96 v48.26,30.48 48.26,29.84 51.02,27.09 C23.2 51.02,23.71 v48.9,21.59 | v62.66,13.34 v51.49,13.34 | v57.15,30.48 52.28,30.48 49.74,33.02
  Bottom 1.016: JP5.2 14.61,59.05 | 14.61,59.05 14.61,49.53 | 14.61,49.53 14.61,43.18 v14.61,40.64 10.16,36.2 10.16,29.84 v9.53,29.21 v9.53,15.24 | 14.61,59.05 15.88,57.78 20.95,57.78 24.13,60.96 24.13,64.14 25.4,65.41 27.94,67.94 39.37,67.94 41.91,65.41 46.77,60.54 | v30.48,45.09 19.05,45.09 14.61,49.53 | v24.77,36.83 20.95,36.83 | 46.77,60.33 48.05,59.05 57.78,59.05 59.05,60.33 61.59,62.87 v66.67,62.87 74.93,62.87 81.28,56.52 v81.28,41.91 81.92,41.27 81.92,36.2 80.64,34.92 76.2,34.92 74.3,33.02 v73.66,33.02 | v60.33,22.23 49.53,22.23
  pour Bottom (isolate 1.2): 1,61 9,69 74,69 84,59 84,27 83,26 73,26 68,21 68,3 67.5,2 44.5,2 44.5,22 40,26 18,26 15,23 1,23
I2C1_SCL
  Top 0.203: R1.1 34.71,59.91 36.51,58.1 36.83,57.78 44.45,57.78 50.69,51.55 U1.58
  Top 0.305: JP1.2 33.66,62.02 R1.1
I2C1_SDA
  Top 0.203: R2.1 35.77,57.15 44.45,57.15 50.19,51.41 U1.59
  Top 0.305: JP1.3 31.11,63.5 31.96,62.65 R2.1
LED_BLUE
  Top 0.203: U1.10 39.26,40.52 35.56,36.83 35.56,33.02 34.29,31.75 R27.2
LED_GREEN
  Top 0.203: U1.9 38.62,41.02 34.92,37.33 34.92,34.92 34.29,34.29 R28.2
LED_RED
  Top 0.203: U1.8 37.98,41.52 33.87,37.41 R29.2
N$1  (via drill 0.5)
  Top 0.203: U1.60 49.69,48.74 v48.9,49.53
  Bottom 0.305: R19.2 48.48,49.95 v48.9,49.53
N$2
  Top 0.305: J1.2 69.89,62.83 70.48,62.23 R4.1
N$3
  Top 0.305: J1.3 69.23,64.16 67.94,62.87 R3.1
N$4
  Top 0.203: C22.1 60.96,26.67 59.05,28.57 57.47,28.57 56.2,29.84 56.2,32.78 54.69,34.29 U1.31
N$5
  Top 0.305: R9.2 R6.1 28.79,23.07 27.94,22.23 26.67,22.23 26.04,21.59 IC1.1
N$6
  Top 0.203: U1.7 37.58,42.02 36.2,40.64 33.12,40.64
  Top 0.254: 33.12,40.64 PB1.2 28.04,40.55 26.45,42.12 C4.1 R8.1
N$7  (via drill 0.5)
  Top 0.406: C27.1 C25.1 7.41,11.85 v7.62,12.06
  Top 0.61: IC3.2 12.38,14.93 v13.34,13.97 R20.1
  Bottom 0.406: v13.34,13.97 11.43,12.06 v7.62,12.06
N$8
  Top 0.305: IC1.2 24.77,22.86 25.4,23.5 R6.2
N$9  (via drill 0.5)
  Top 0.254: IC1.3 23.5,22.23 v22.86,22.86
  Top 0.406: JP3.2 18.41,8.26 v19.68,9.53
  Bottom 0.813: v19.68,9.53 19.68,21.59 20.95,22.86 v22.86,22.86
N$10
  Top 0.254: U1.5 40.16,43.02 33.47,49.72 Z1.3
N$11
  Top 0.203: U1.47 61.67,44.52 62.87,45.72 62.87,48.9 61.59,50.16 C26.1
N$12  (via drill 0.5)
  Top 0.406: JP4.2 29.21,6.99 27.3,8.89 22.86,8.89 v22.23,9.53 | IC1.5 v22.23,12.7
  Bottom 0.813: v22.23,9.53 v22.23,12.7
N$13
  Top 0.305: R7.1 30.9,15.04 R10.2 29.84,15.88 29.21,15.24 29.21,13.97 27.94,12.7 25.4,12.7 24.77,13.34 IC1.7
N$14  (via drill 0.5)
  Top 0.254: R15.2 24.55,40.22 v24.13,40.64
  Top 0.406: R12.1 R16.2 C9.1 19.05,38.73 v20.32,40.01
  Bottom 0.813: v24.13,40.64 20.95,40.64 v20.32,40.01
N$15
  Top 0.305: IC1.6 23.5,13.34 24.77,12.06 29.84,12.06 30.9,13.12 R7.2
N$16
  Top 1.016: S1.1 S1.4 JP6.2
N$17
  Top 1.016: JP5.1 12.06,63.5 7.62,59.05 S1.2 S1.5
N$18
  Top 0.305: R13.1 C8.1
N$19
  Top 0.406: R27.1 LED1.A
N$20
  Top 0.203: 51.29,9.74 C8.2 R14.2
  Top 0.305: 51.29,9.74 R11.2
  Top 0.61: PB2.1 R11.2
N$21
  Top 0.406: R28.1 LED2.A
N$22  (via drill 0.5)
  Top 0.203: U1.14 44.24,38.52 43.18,37.47 43.18,26.67 v45.72,24.13
  Top 0.61: R14.1 47.55,13.88 v48.4,14.72
  Bottom 0.203: v48.4,14.72 48.4,17.86 47,19.25 47,22.85 46.35,23.5
  Bottom 0.254: 46.35,23.5 v45.72,24.13
N$23
  Top 0.406: R29.1 LED3.A
N$24
  Top 0.203: U1.1 44.51,45.02 43.18,46.35 R17.1
  Top 0.61: TP7.TP 40.5,48 41.75,46.75 43.16,46.75 R17.1
N$25
  Top 0.203: U1.3 42.34,44.02 36.83,49.53 36.83,53.34 34.06,56.11 Z2.2
  Top 0.305: 32.16,55.88 Z2.2
  Top 0.406: C10.1 32.16,55.88
N$26
  Top 0.203: U1.4 41.56,43.52 35.56,49.53 35.56,52.07 34.52,53.11 Z2.1
  Top 0.254: 32.16,53.34 Z2.1
  Top 0.305: 31.98,52.7 Z2.1
  Top 0.406: C11.1 32.16,53.34
N$27
  Top 0.203: R23.2 55.88,21.59 58.98,18.49 58.98,10.79 58.13,9.95 R22.2
  Top 0.61: PB3.1 R22.2
N$28
  Top 0.203: U1.57 51.19,51.69 43.81,59.05 41.17,59.05 TP6.TP
N$29
  Top 0.203: R24.2 61.1,9.95 60.25,10.79 60.25,19.12 58.42,20.95 R25.2
  Top 0.61: PB4.1 R24.2
N$30
  Top 0.203: U1.56 51.69,51.81 TP8.TP
N$31
  Top 0.203: U1.55 52.19,51.95 46,58.14 TP9.TP
N$32
  Top 0.203: U1.54 52.69,57.81 TP10.TP
N$33
  pour Top (isolate 1): 9,69 74,69 84,59 84,27 83,26 73,26 68,21 68,2 8,2 2,8 2,62
N$34
  Top 0.203: U1.29 53.69,29.18 TP11.TP
N$35
  Top 0.203: U1.30 54.19,33.76 54.93,33.02 TP12.TP
N$41
  Top 0.305: U2.7 39.65,18.7 39.37,18.41 39.37,17.14 40.01,16.51 41.27,16.51 41.49,16.3 R18.1
NRF_CE  (via drill 0.5)
  Top 0.203: U1.38 60.34,40.02 v60.96,40.64 | RF1.3 77.11,28.57 73.93,31.75 64.77,31.75 v60.96,35.56
  Bottom 0.406: v60.96,35.56 v60.96,40.64
NRF_CS  (via drill 0.5)
  Top 0.203: U1.37 61.75,39.52 v62.23,40.01 | RF1.4 75.83,28.57 73.3,31.11 63.5,31.11 v62.23,32.38
  Bottom 0.406: v62.23,32.38 v62.23,40.01
NRF_INT  (via drill 0.5)
  Top 0.203: U1.39 58.94,40.52 v59.69,41.27 | v59.69,33.02 59.69,30.48 64.14,26.04 69.48,26.04 70.75,24.77 RF1.8
  Bottom 0.406: v59.69,33.02 v59.69,41.27
PB1
  Top 0.203: U1.27 52.69,26.05 53.34,25.4 55.66,25.4 R23.1
PB2
  Top 0.203: U1.28 53.19,28.09 54.61,26.67 57.37,26.67 R25.1
SPI1_MISO
  Top 0.203: U1.22 50.19,21.61 49.22,20.64 U2.13
SPI1_MOSI
  Top 0.203: U1.23 50.69,20.84 49.84,20 U2.12
SPI1_SCK
  Top 0.203: U2.15 47.98,21.95 49.69,23.65 U1.21
SPI2_MISO  (via drill 0.5)
  Top 0.203: U1.35 65.19,38.52 v66.04,39.37 | RF1.7 72.03,25.4 70.12,27.3 v67.94,27.3
  Top 0.406: U3.2 v80.01,38.1
  Bottom 0.406: v67.94,27.3 67.31,27.3 66.67,27.94 66.67,31.11 | 66.67,31.11 66.67,38.73 v66.04,39.37 | v80.01,38.1 76.83,38.1 69.22,30.48 67.31,30.48 66.67,31.11
SPI2_MOSI  (via drill 0.5)
  Top 0.203: U1.36 63.16,39.02 v64.14,40.01 64.77,40.64 U3.5 | RF1.6 73.3,26.04 70.75,28.57 v65.41,28.57
  Bottom 0.406: v64.14,40.01 64.77,39.37 64.77,29.21 v65.41,28.57
SPI2_SCK
  Top 0.203: 68.58,39.37 67.23,38.02 58.42,38.02 | U1.34 58.42,38.02 | RF1.5 74.56,28.57 73.3,29.84 62.87,29.84 60.96,31.75 60.96,33.66 59.69,34.92 59.69,36.76 58.42,38.02
  Top 0.254: U3.6 68.58,39.37
SPI3_MISO
  Top 0.203: U1.52 53.69,61.25 52.07,62.87
  Top 0.406: 52.07,62.87 JP7.4
SPI3_MOSI
  Top 0.203: U1.53 53.19,59.21 49.53,62.87
  Top 0.406: 49.53,62.87 JP7.5
SPI3_NSS  (via drill 0.5)
  Top 0.203: 43.81,64.77 50.16,58.42 v50.16,57.15
  Top 0.254: 57.15,67.94 56.52,68.58 45.09,68.58 43.81,67.31 43.81,64.77 | U1.20 49.19,37.76 v52.07,40.64
  Top 0.406: JP7.2 57.15,67.94
  Bottom 0.254: v52.07,40.64 52.07,50.16 52.07,55.24 v50.16,57.15
SPI3_SCK
  Top 0.203: U1.51 54.19,61.17 54.61,61.59
  Top 0.406: 54.61,61.59 JP7.3
SWCLK
  Top 0.203: U1.49 55.19,51.38
  Top 0.254: 55.19,51.38 56.58,52.77 J2.4
SWDIO
  Top 0.203: U1.46 56.3,44.02 55.88,44.45 55.88,50.8
  Top 0.254: 57.83,52.74 55.88,50.8
  Top 0.406: J2.3 57.83,52.74
UART2_RX  (via drill 0.5)
  Top 0.254: U1.17 47.69,34.98 46.99,34.29 v45.72,34.29
  Bottom 0.254: 26.67,29.84 30.48,33.66 36.83,33.66 40.64,29.84 42.55,29.84 43.18,30.48 43.18,33.02 44.45,34.29 v45.72,34.29
  Bottom 0.406: 26.67,29.84 JP2.3
UART2_TX  (via drill 0.5)
  Top 0.203: U1.16 45.15,37.52 44.45,36.83 44.45,29.21 v45.09,28.57
  Bottom 0.254: v45.09,28.57 40.01,28.57 36.83,31.75 31.11,31.75 29.21,29.84
  Bottom 0.406: 29.21,29.84 JP2.2
USB_DM
  Top 0.203: R4.2 70.48,49.53 63.98,43.02 U1.44
USB_DP
  Top 0.203: R3.2 67.94,49.53 61.94,43.52 U1.45
  Top 0.406: R5.2 65.19,60.54 66.89,58.84 R3.2
VBUS
  Top 0.203: 70.53,63.45 73.03,60.96 73.03,49.53 65.72,42.23 58.74,42.23 58.53,42.02 U1.42
  Top 0.305: J1.1 70.53,63.45
VCC  (via drill 0.5)
  Top 0.203: U1.48 58.99,45.02 60.54,46.57 C28.2 | U1.64 47.69,47.56 46.99,48.26 v45.09,48.26 | 43.4,48.26 R17.2 | U2.16 47.36,22.59 48.26,23.5 v48.26,24.13 | U1.32 55.19,34.98 55.88,34.29 v57.15,34.29
  Top 0.254: C31.1 70.91,33.23 | R26.1 75.98,33.87 | U3.3 81.28,39.37 81.92,38.73 81.92,33.66 80.01,31.75 | U1.19 48.69,37.67 v48.26,38.1
  Top 0.406: C18.1 C19.1 11.21,24.55 TP1.TP | U3.7 U3.8 68.58,36.83 67.94,36.2 v67.94,34.29 68.58,33.66 C31.1 70.91,34.08 71.75,34.92 74.93,34.92 75.98,33.87 | 75.98,33.44 R26.1 76.2,33.44 76.2,32.38 76.83,31.75 80.01,31.75 80.64,31.11 80.64,28 C32.1 80.64,27.89 80.64,26.04 79.64,25.04 RF1.1 79.64,21.64 78,20 68,20 66,18 66,4 64.44,2.44 PB4.2 PB3.2 PB2.2 48.82,2.44 47.55,3.71 R13.2 | R5.1 61.81,56.52 J2.1 60.33,59.69 59.69,60.33 JP7.1 | R8.2 28.16,49.11 | Z1.4 29.23,49.72 C5.1 | 43.4,48.26 v45.09,48.26 | C28.2 60.96,47.62 v61.59,48.26
  Top 0.61: R1.2 36.41,65.19 JP1.1 | R2.2 30.27,61.81 v29.84,62.23 | R17.2 43.18,49.53 41.91,50.8 v38.73,50.8 | JP2.1 31.75,26.04 31.11,25.4 16.19,25.4 13.02,28.57 | v48.26,38.1 48.05,38.31 48.05,40.64 49.31,41.91 54.61,41.91 v54.83,42.12 | v57.15,34.29 C24.2
  Top 0.813: TP1.TP 13.02,26.35 13.02,28.57 IC2.2 19.22,31.29 22.23,34.29 22.23,46.35 v24.13,48.26 27.3,48.26 28.16,49.11 C5.1
  Bottom 0.406: C16.1 48.05,44.66 | C17.1 48.05,38.31 v48.26,38.1
  Bottom 0.61: 36.41,65.19 JP1.1 | C16.1 C17.1 | 48.05,44.66 45.09,47.62 v45.09,48.26 | 49.31,25.18 v48.26,24.13 | 61.59,55.24 J2.1 | C23.1 49.31,26.25 45.72,29.84 45.72,32.38 46.99,33.66 46.99,36.83 v48.26,38.1 | 54.61,41.91 v54.83,42.12
  Bottom 0.813: C23.1 49.31,25.18 | v67.94,34.29 67.94,41.27 65.41,43.81 62.23,43.81 | 62.23,43.81 56.52,43.81 v54.83,42.12 | 62.23,43.81 61.59,44.45 v61.59,48.26 61.59,55.24 | v57.15,34.29 57.15,35.56 54.61,38.1 54.61,41.91
  Bottom 1.016: 36.41,65.19 36.41,62.87 35.77,62.23 v29.84,62.23 24.13,56.52 24.13,52.07 | v24.13,48.26 24.13,52.07 | v38.73,50.8 25.4,50.8 24.13,52.07
VIN
  Top 0.406: R12.2 13.34,44.45 12.06,43.18 12.06,37.47 | IC2.3 7.24,33.48 C15.1 C12.1 2.75,32.6 1.52,31.36 1.52,22.36 3.81,20.32 5.08,20.32 6.35,19.05 C20.1 | C21.1 C20.1 | C20.1 8.47,18 9.53,19.05 11.26,19.05 IC3.3
  Top 0.813: JP6.1 9.53,40.01 12.06,37.47 IC2.3

### Text on the board
tPlace: GND SDA SCL VCC | GND MO MI SCK NSS VCC | V+ | V- | SWD | VBAT | ABB CNCRC / MTOOL / Ver.5 Alpha | GND RX TX Vcc | Vcc | PA0 | PB1 | PB2 | AGND | AVCC CH1 AGND | AVCC CH0 AGND | AVCC